# EAGLE design KMO_IO_MV1_2 (EAGLE 9.3.1)

## Sheet 1 of 2
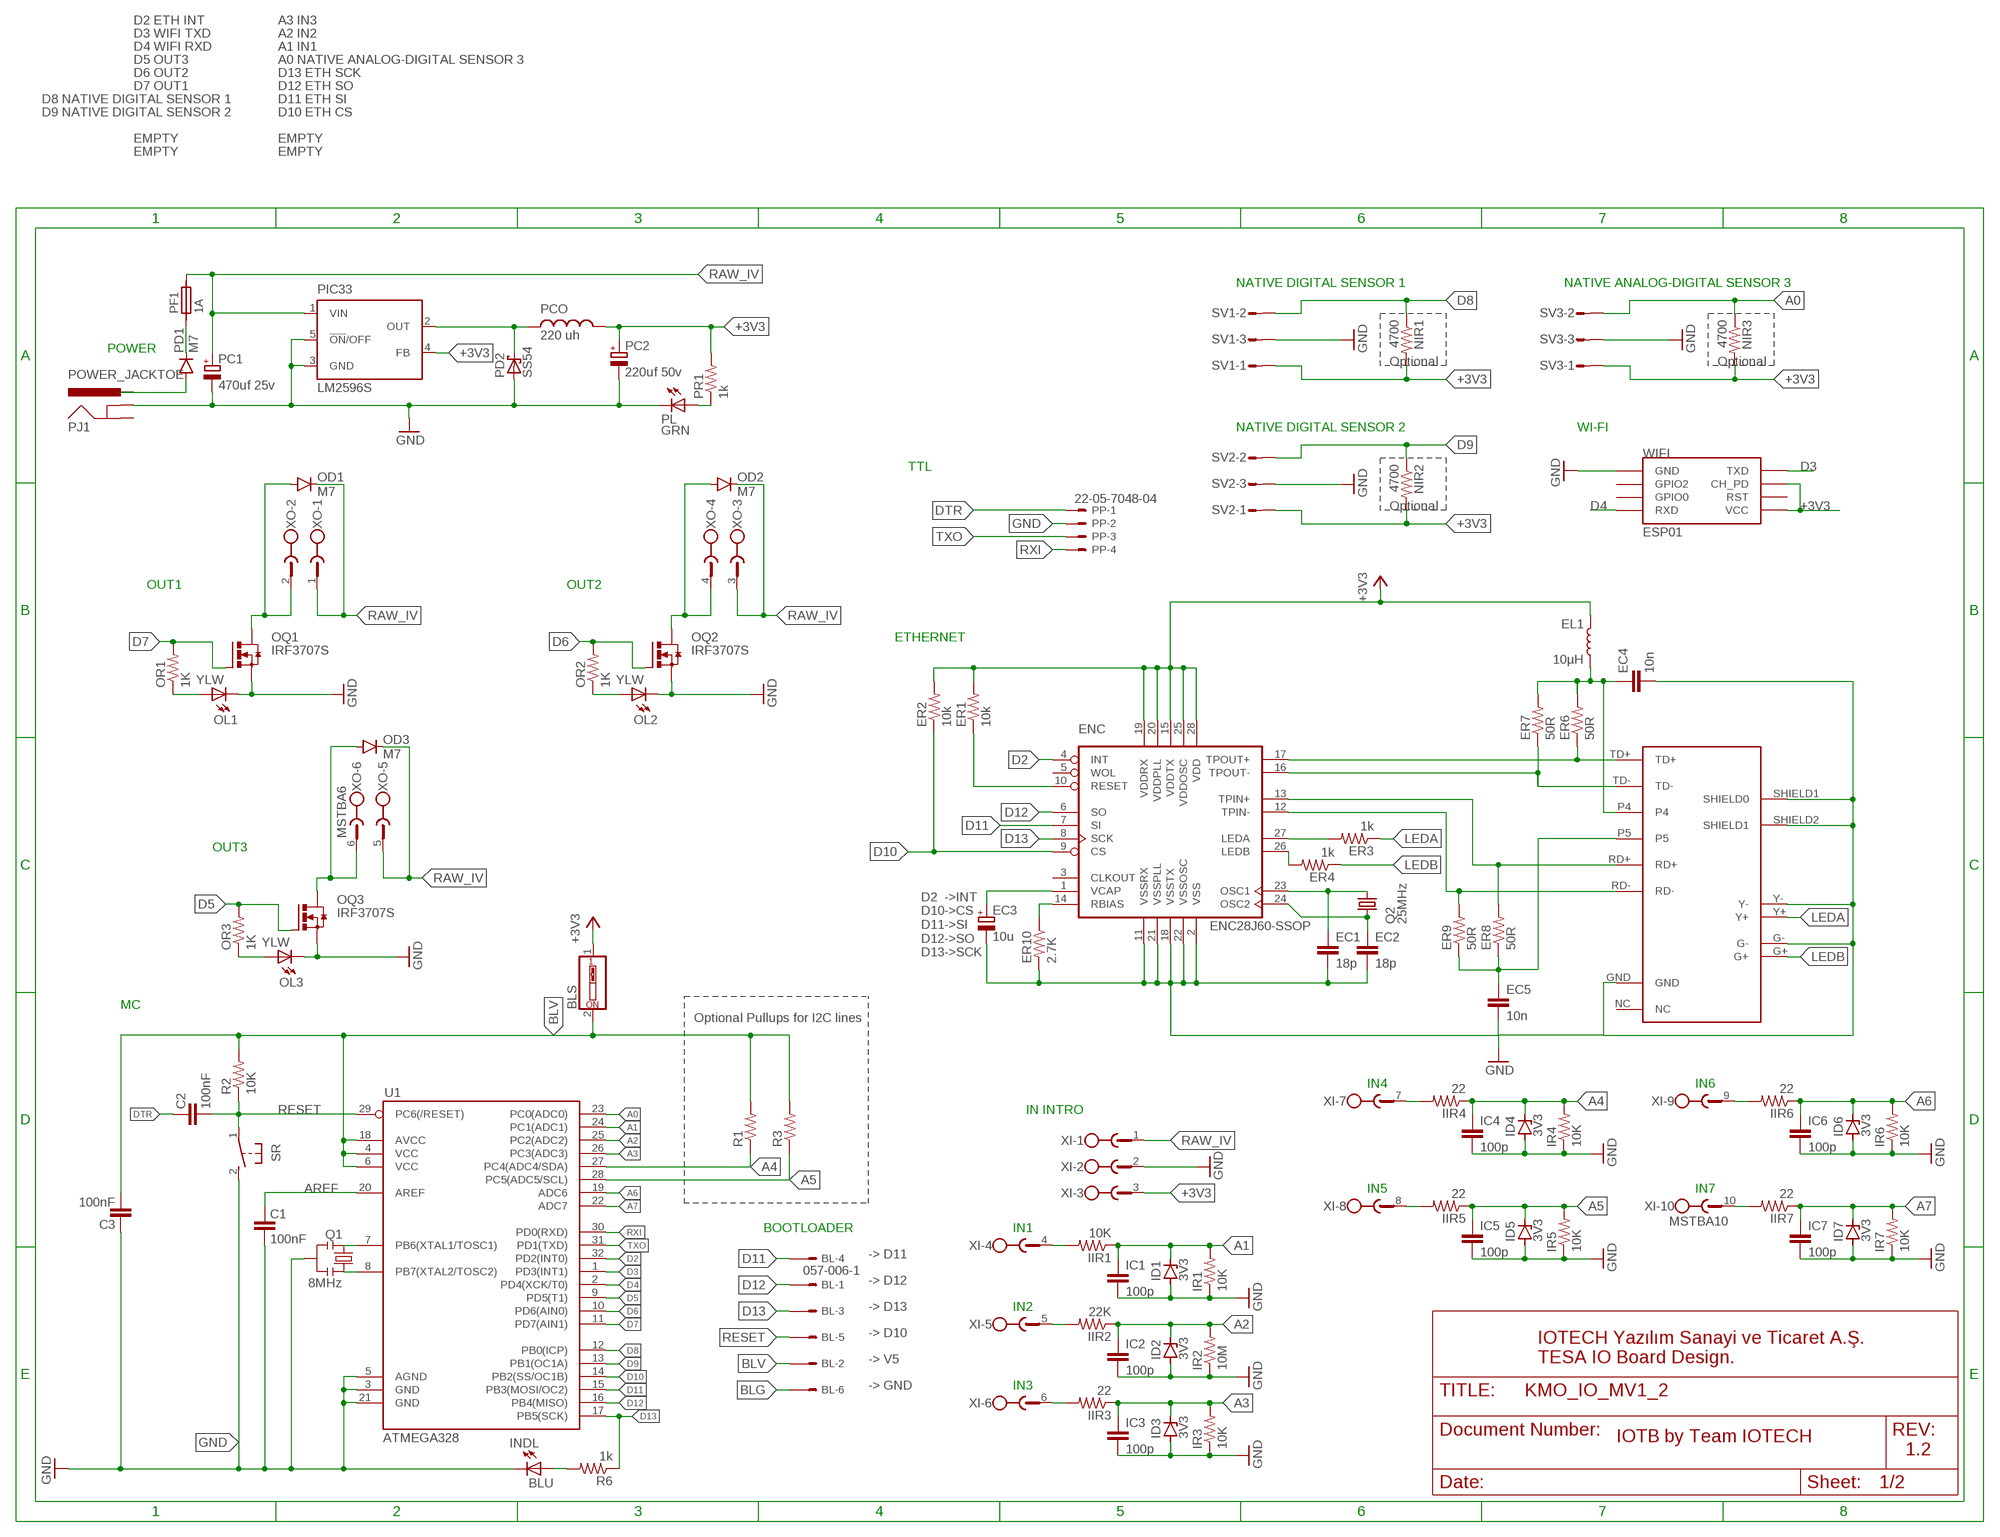
[diagram p0: schematic, sheet 1]

### Parts
BL  057-006-1  [057-006-1]
BLS  SW_DIP-1  [EDG-01]
C1  100nF  CAP0805  [0805]
C2  100nF  CAP0805  [0805]
C3  100nF  CAP0805  [0805]
EC1  18p  CAP0805  [0805]
EC2  18p  CAP0805  [0805]
EC3  10u  CPOL-EUCT3216  [CT3216]
EC4  10n  CAP0805  [0805]
EC5  10n  CAP0805  [0805]
EL1  10µH  INDUCTOR-0805-3.3UH  [0805]
ENC  ENC28J60-SSOP  [SSOP28]
ER1  10k  RESISTOR0805-RES  [0805]
ER2  10k  RESISTOR0805-RES  [0805]
ER3  1k  RESISTOR0805-RES  [0805]
ER4  1k  RESISTOR0805-RES  [0805]
ER6  50R  RESISTOR0805-RES  [0805]
ER7  50R  RESISTOR0805-RES  [0805]
ER8  50R  RESISTOR0805-RES  [0805]
ER9  50R  RESISTOR0805-RES  [0805]
ER10  2.7K  RESISTOR0805-RES  [0805]
IC1  100p  CAP0805  [0805]
IC2  100p  CAP0805  [0805]
IC3  100p  CAP0805  [0805]
IC4  100p  CAP0805  [0805]
IC5  100p  CAP0805  [0805]
IC6  100p  CAP0805  [0805]
IC7  100p  CAP0805  [0805]
ID1  3V3  ZENER-DIODESOT23  [SOT23]
ID2  3V3  ZENER-DIODESOT23  [SOT23]
ID3  3V3  ZENER-DIODESOT23  [SOT23]
ID4  3V3  ZENER-DIODESOT23  [SOT23]
ID5  3V3  ZENER-DIODESOT23  [SOT23]
ID6  3V3  ZENER-DIODESOT23  [SOT23]
ID7  3V3  ZENER-DIODESOT23  [SOT23]
IIR1  10K  RESISTOR0805-RES  [0805]
IIR2  22K  RESISTOR0805-RES  [0805]
IIR3  22  RESISTOR0805-RES  [0805]
IIR4  22  RESISTOR0805-RES  [0805]
IIR5  22  RESISTOR0805-RES  [0805]
IIR6  22  RESISTOR0805-RES  [0805]
IIR7  22  RESISTOR0805-RES  [0805]
INDL  BLU  LEDCHIP-LED0805  [CHIP-LED0805]
IR1  10K  RESISTOR0805-RES  [0805]
IR2  10M  RESISTOR0805-RES  [0805]
IR3  10K  RESISTOR0805-RES  [0805]
IR4  10K  RESISTOR0805-RES  [0805]
IR5  10K  RESISTOR0805-RES  [0805]
IR6  10K  RESISTOR0805-RES  [0805]
IR7  10K  RESISTOR0805-RES  [0805]
NIR1  4700  RESISTOR0805-RES  [0805]
NIR2  4700  RESISTOR0805-RES  [0805]
NIR3  4700  RESISTOR0805-RES  [0805]
OD1  M7  DIODESMA  [SMA-DIODE]
OD2  M7  DIODESMA  [SMA-DIODE]
OD3  M7  DIODESMA  [SMA-DIODE]
OL1  YLW  LEDCHIP-LED0805  [CHIP-LED0805]
OL2  YLW  LEDCHIP-LED0805  [CHIP-LED0805]
OL3  YLW  LEDCHIP-LED0805  [CHIP-LED0805]
OQ1  IRF3707S  IRF3704S  [D2PACK]
OQ2  IRF3707S  IRF3704S  [D2PACK]
OQ3  IRF3707S  IRF3704S  [D2PACK]
OR1  1K  RESISTOR0805-RES  [0805]
OR2  1K  RESISTOR0805-RES  [0805]
OR3  1K  RESISTOR0805-RES  [0805]
PC1  470uf 25v  CPOL-EU140CLH-1010  [140CLH-1010]
PC2  220uf 50v  CPOL-EU140CLH-1010  [140CLH-1010]
PCO  220 uh  MSS1260  [MSS1260]
PD1  M7  DIODESMA  [SMA-DIODE]
PD2  SS54  SCHOTTKY-DIODESMD  [SMB]
PF1  1A  SIBA194600  [1820]
PIC33  LM2596S  [TO263-5]
PJ1  POWER_JACKTOE  [POWER_JACK_SMD_OVERPASTE_TOE]
PL  GRN  LEDCHIP-LED0805  [CHIP-LED0805]
PP  22-05-7048-04  [7395-04]
PR1  1k  RESISTOR0805-RES  [0805]
Q1  8MHz  RESONATOR1:1  [RESONATOR-SMD-1:1]
Q2  25MHz  KX-9B  [5.0X3.2_2]
R1  RESISTOR0805-RES  [0805]
R2  10K  RESISTOR0805-RES  [0805]
R3  RESISTOR0805-RES  [0805]
R6  1k  RESISTOR0805-RES  [0805]
SR  31-XX  [B3F-31XX]
SV1  S03P  [S03P]
SV2  S03P  [S03P]
SV3  S03P  [S03P]
U1  ATMEGA328  ATMEGA168  [TQFP32-08]
U$2  HR911105A  [RJ45]
WIFI  ESP01  [ESP01]
XI  MSTBA10  [MSTBA10]
XO  MSTBA6  [MSTBA6]

### Nets
+3V3: BLS.1 EL1.1 ENC.15(VDDTX) ENC.19(VDDRX) ENC.20(VDDPLL) ENC.25(VDDOSC) ENC.28(VDD) ER1.2 ER2.2 NIR1.2 NIR2.2 NIR3.2 PC2.+ PCO.P$1 PIC33.4(FB) PR1.2 SV1.1 SV2.1 SV3.1 WIFI.CH_PD WIFI.VCC XI.3
A0: NIR3.1 SV3.2 U1.23(PC0(ADC0))
A1: IC1.1 ID1.3(C) IIR1.1 IR1.2 U1.24(PC1(ADC1))
A2: IC2.1 ID2.3(C) IIR2.1 IR2.2 U1.25(PC2(ADC2))
A3: IC3.1 ID3.3(C) IIR3.1 IR3.2 U1.26(PC3(ADC3))
A4: IC4.1 ID4.3(C) IIR4.1 IR4.2 R1.1 U1.27(PC4(ADC4/SDA))
A5: IC5.1 ID5.3(C) IIR5.1 IR5.2 R3.1 U1.28(PC5(ADC5/SCL))
A6: IC6.1 ID6.3(C) IIR6.1 IR6.2 U1.19(ADC6)
A7: IC7.1 ID7.3(C) IIR7.1 IR7.2 U1.22(ADC7)
AREF: C1.2 U1.20(AREF)
BLG: BL.6
BLV: BL.2 BLS.2 C3.1 R1.2 R2.2 R3.2 U1.4(VCC) U1.6(VCC) U1.18(AVCC)
D2: ENC.4(INT) U1.32(PD2(INT0))
D3: U1.1(PD3(INT1)) WIFI.TX(TXD)
D4: U1.2(PD4(XCK/T0)) WIFI.RX(RXD)
D5: OQ3.1(G) OR3.2 U1.9(PD5(T1))
D6: OQ2.1(G) OR2.2 U1.10(PD6(AIN0))
D7: OQ1.1(G) OR1.2 U1.11(PD7(AIN1))
D8: NIR1.1 SV1.2 U1.12(PB0(ICP))
D9: NIR2.1 SV2.2 U1.13(PB1(OC1A))
D10: ENC.9(CS) ER2.1 U1.14(PB2(SS/OC1B))
D11: BL.4 ENC.7(SI) U1.15(PB3(MOSI/OC2))
D12: BL.1 ENC.6(SO) U1.16(PB4(MISO))
D13: BL.3 ENC.8(SCK) R6.1 U1.17(PB5(SCK))
DTR: C2.2 PP.1
EP4: EC4.1 EL1.2 ER6.2 ER7.2 U$2.P4
EP5: EC5.1 ER8.1 ER9.1 U$2.P5
GND: C1.1 C3.2 EC1.2 EC2.2 EC3.- EC4.2 EC5.2 ENC.2(VSS) ENC.11(VSSRX) ENC.18(VSSTX) ENC.21(VSSPLL) ENC.22(VSSOSC) ER10.2 IC1.2 IC2.2 IC3.2 IC4.2 IC5.2 IC6.2 IC7.2 ID1.1(A) ID2.1(A) ID3.1(A) ID4.1(A) ID5.1(A) ID6.1(A) ID7.1(A) INDL.C IR1.1 IR2.1 IR3.1 IR4.1 IR5.1 IR6.1 IR7.1 OL1.C OL2.C OL3.C OQ1.3(S) OQ2.3(S) OQ3.3(S) PC1.- PC2.- PD2.A PIC33.3(GND) PIC33.5(!ON!/OFF) PJ1.GND(GNDBREAK) PL.C PP.2 Q1.2 SR.2(S) SV1.3 SV2.3 SV3.3 U1.3(GND) U1.5(AGND) U1.21(GND) U$2.G- U$2.GND U$2.SHIELD1(SHIELD0) U$2.SHIELD2(SHIELD1) U$2.Y- WIFI.GND XI.2
LEDA: ER3.1 U$2.Y+
LEDB: ER4.1 U$2.G+
N$1: OD3.A OQ3.2(D) XO.6
N$2: PD1.C PF1.1
N$3: OD1.A OQ1.2(D) XO.2
N$4: OD2.A OQ2.2(D) XO.4
N$5: INDL.A R6.2
N$6: OL3.A OR3.1
N$7: OL2.A OR2.1
N$8: OL1.A OR1.1
N$9: ENC.27(LEDA) ER3.2
N$10: Q1.3 U1.8(PB7(XTAL2/TOSC2))
N$11: PL.A PR1.1
N$12: IIR1.2 XI.4
N$13: EC3.+ ENC.1(VCAP)
N$14: ENC.26(LEDB) ER4.2
N$15: Q1.1 U1.7(PB6(XTAL1/TOSC1))
N$16: PCO.P$2 PD2.C PIC33.2(OUT)
N$17: ENC.10(RESET) ER1.1
N$18: PD1.A PJ1.VIN0(PWR)
N$19: ENC.14(RBIAS) ER10.1
N$20: IIR2.2 XI.5
N$21: IIR3.2 XI.6
N$22: EC2.1 ENC.24(OSC2) Q2.1
N$23: IIR4.2 XI.7
N$24: EC1.1 ENC.23(OSC1) Q2.2
N$25: IIR5.2 XI.8
N$26: IIR6.2 XI.9
N$27: IIR7.2 XI.10
RAW_IV [vcc]: OD1.C OD2.C OD3.C PC1.+ PF1.2 PIC33.1(VIN) XI.1 XO.1 XO.3 XO.5
RD+: ENC.13(TPIN+) ER8.2 U$2.RD+
RD-: ENC.12(TPIN-) ER9.2 U$2.RD-
RESET: BL.5 C2.1 R2.1 SR.1(P) U1.29(PC6(/RESET))
RXI: PP.4 U1.30(PD0(RXD))
TD+: ENC.17(TPOUT+) ER6.1 U$2.TD+
TD-: ENC.16(TPOUT-) ER7.1 U$2.TD-
TXO: PP.3 U1.31(PD1(TXD))
Unconnected: ENC.3(CLKOUT) ENC.5(WOL) PJ1.P$4(GND) U$2.NC WIFI.GPIO0 WIFI.GPIO2 WIFI.RST

### Notes on the sheet
- D2 ETH INT | A3 IN3
- D3 WIFI TXD | A2 IN2
- D4 WIFI RXD | A1 IN1
- D5 OUT3 | A0 NATIVE ANALOG-DIGITAL SENSOR 3
- D6 OUT2 | D13 ETH SCK
- D7 OUT1 | D12 ETH SO
- D8 NATIVE DIGITAL SENSOR 1 | D11 ETH SI
- D9 NATIVE DIGITAL SENSOR 2 | D10 ETH CS
- EMPTY | EMPTY
- EMPTY | EMPTY
- NATIVE DIGITAL SENSOR 1 | NATIVE ANALOG-DIGITAL SENSOR 3
- POWER
- Optional | Optional
- NATIVE DIGITAL SENSOR 2 | WI-FI
- TTL
- Optional
- OUT1 | OUT2
- ETHERNET
- OUT3
- D2  ->INT
  D10->CS
  D11->SI
  D12->SO
  D13->SCK
- MC
- Optional Pullups for I2C lines
- IN4 | IN6
- IN INTRO
- IN5 | IN7
- BOOTLOADER | IN1
- -> D11
- -> D12
- -> D13 | IN2
- -> D10
- -> V5
- IOTECH Yazılım Sanayi ve Ticaret A.Ş.
  TESA IO Board Design.
- -> GND | IN3
- IOTB by Team IOTECH
- 1.2

## Sheet 2 of 2
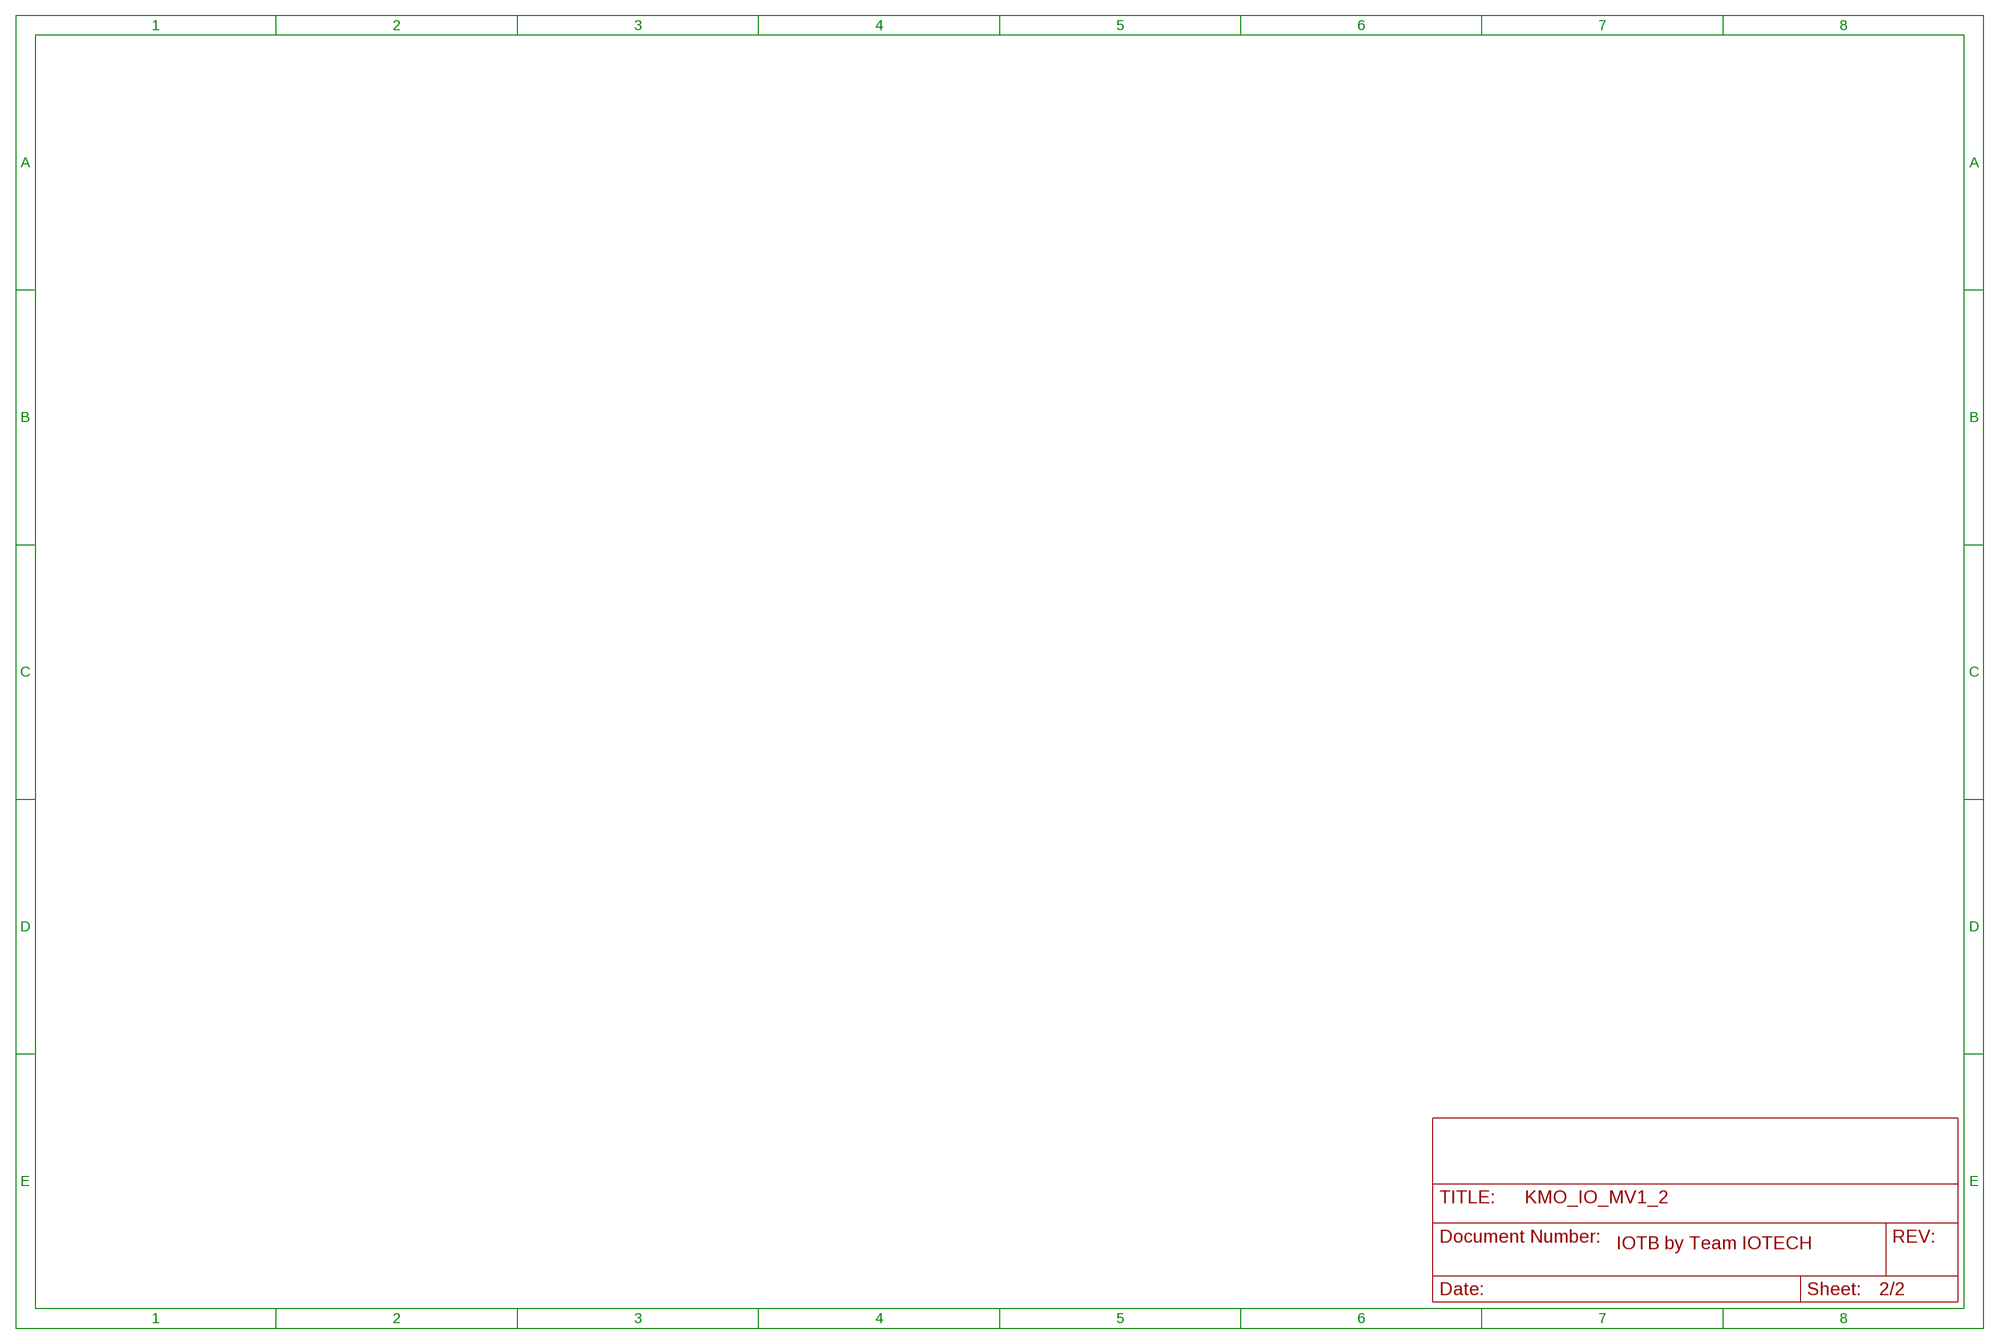
[diagram p1: schematic, sheet 2]

### Notes on the sheet
- IOTB by Team IOTECH

## Library data of the parts
BL = con-panduit:057-006-: CONNECTOR 6-pin series 057 contact pc board low profile headers; OC_FARNELL: unknown; OC_NEWARK: unknown
BLS = special:SW_DIP-1: DIP SWITCH
C1-C3 EC1 EC2 EC4 EC5 IC1-IC7 = SparkFun-Passives:CAP: Capacitor Standard 0603 ceramic capacitor, and 0.1" leaded capacitor.
EC3 PC1 PC2 = rcl:CPOL-EU: POLARIZED CAPACITOR, European symbol; SPICEPREFIX: C
EL1 = SparkFun-Coils:INDUCTOR: Inductors Resist changes in electrical current. Basically a coil of wire. SparkFun Products: SparkFun Load Cell Amplifier - HX711 <https://www.sparkfun.com/products/13879> IOIO-OTG - V2.2 <https://www.sparkfun.com/products/13613>; PROD_ID: NDUC-13076; VALUE: 3.3µH/±20%/450mA
ENC = microchip-enc28j60:ENC28J60-*: Microchip 10Mbit Eth. contoller with SPI interface
ER1-ER4 ER6-ER10 IIR1-IIR7 IR1-IR7 NIR1-NIR3 OR1-OR3 PR1 R1-R3 R6 = SparkFun-Passives:RESISTOR: Resistor Basic schematic elements and footprints for 0603, 1206, and PTH resistors.
ID1-ID7 = diode:ZENER-DIODE: Z-Diode
INDL OL1-OL3 PL = led:LED: LED OSRAM: - CHIPLED LG R971, LG N971, LY N971, LG Q971, LY Q971, LO R971, LY R971 LH N974, LH R974 LS Q976, LO Q976, LY Q976 LO Q996 - Hyper CHIPLED LW Q18S LB Q993, LB Q99A, LB R99A - SideLED LS A670, LO A670, LY A670, LG A670, LP A670 LB A673, LV A673, LT A673, LW A673 LH A674 LY A675 LS A676, LA A676, LO A676, LY A676, LW A676 LS A679, LY A679, LG A679 - Hyper Micro SIDELED® LS Y876, LA Y876, LO Y876, LY Y876 LT Y87S - SmartLED LW L88C, LW L88S LB L89C, LB L89S, LG L890 LS L89K, LO L89K, LY L89K LS L896, LA L896, LO L896, LY L896 - TOPLED LS T670, LO T670, LY T670, LG T670, LP T670 LSG T670, LSP T670, LSY T670, LOP T670, LYG T670 LG T671, LOG T671, LSG T671 LB T673, LV T673, LT T673, LW T673 LH T674 LS T676, LA T676, LO T676, LY T676, LB T676, LH T676, LSB T676, LW T676 LB T67C, LV T67C, LT T67C, LS T67K, LO T67K, LY T67K, LW E67C LS E67B, LA E67B, LO E67B, LY E67B, LB E67C, LV E67C, LT E67C LW T67C LS T679, LY T679, LG T679 LS T770, LO T770, LY T770, LG T770, LP T770 LB T773, LV T773, LT T773, LW T773 LH T774 LS E675, LA E675, LY E675, LS T675 LS T776, LA T776, LO T776, LY T776, LB T776 LHGB T686 LT T68C, LB T68C - Hyper Mini TOPLED® LB M676 - Mini TOPLED Santana® LG M470 LS M47K, LO M47K, LY M47K Source: http://www.osram.convergy.de LUXEON: - LUMILED® LXK2-PW12-R00, LXK2-PW12-S00, LXK2-PW14-U00, LXK2-PW14-V00 LXK2-PM12-R00, LXK2-PM12-S00, LXK2-PM14-U00 LXK2-PE12-Q00, LXK2-PE12-R00, LXK2-PE12-S00, LXK2-PE14-T00, LXK2-PE14-U00 LXK2-PB12-K00, LXK2-PB12-L00, LXK2-PB12-M00, LXK2-PB14-N00, LXK2-PB14-P00, LXK2-PB14-Q00 LXK2-PR12-L00, LXK2-PR12-M00, LXK2-PR14-Q00, LXK2-PR14-R00 LXK2-PD12-Q00, LXK2-PD12-R00, LXK2-PD12-S00 LXK2-PH12-R00, LXK2-PH12-S00 LXK2-PL12-P00, LXK2-PL12-Q00, LXK2-PL12-R00 Source: www.luxeon.com KINGBRIGHT: KA-3528ASYC Source: www.kingbright.com
OD1-OD3 PD1 = SparkFun-DiscreteSemi:DIODE: Diode These are standard reverse protection diodes and small signal diodes. SMA package can handle up to about 1A. SOD-323 can handle about 200mA. What the SOD-323 package when ordering, there are some mfgs out there that are 5-pin packages.
OQ1-OQ3 = transistor-power:IRF3704: SMPS MOSFET HEXFET® Power MOSFET Source: http://www.irf.com/product-info/datasheets/data/irf3704.pdf
PCO = inductor-coilcraft:MSS1260: SMT Power Inductor
PD2 = diode:SCHOTTKY-DIODE: Schottky Diode
PF1 = _hhn_PtcFuses_Siba_r500_Ozan:SIBA194600*: SIBA PTC-Fuses, Series 194600, 1812 (4.5 3.2)mm Source: www.siba.de/ Package: SMD 1812 (4.5 x 3.2)mm Technologies: SIBA194600Axxx xxx: Trip-Current * 10 mA Author: Dipl.-Ing. FH Rainer Bayer
PIC33 = national-semiconductor:LM2596: SIMPLE SWITCHER® Power Converter 150 kHz 3A Step-Down Voltage Regulator Source: http://www.national.com/ds/LM/LM2596.pdf; MF: NATIONAL SEMICONDUCTOR; MPN: LM2596S-ADJ/NOPB; OC_FARNELL: 9494367; OC_NEWARK: 41K3842
PJ1 = SparkFun-Connectors:POWER_JACK: Power Jack Connector This is the standard 5.5mm barrel jack for power. The PTH is the most common, proven, reliable, footprint. The Slot footprint only works if the mill layer is transmitted to the PCB fab house so be warned. Here are the connectors we sell at SparkFun: DC Barrel Power Jack/Connector <https://www.sparkfun.com/products/119> (PRT-00119) DC Barrel Power Jack/Connector (SMD) <https://www.sparkfun.com/products/12748> (PRT-12748) DC Barrel Jack Adapter - Breadboard Compatible <https://www.sparkfun.com/products/10811> (PRT-10811) It is used on this SparkFun product (and many, many others): SparkFun RedBoard - Programmed with Arduino <https://www.sparkfun.com/products/12757> (DEV-12757) Also, if you need a mating power supply or connector, please check these out: Wall Adapter Power Supply - 9VDC 650mA <https://www.sparkfun.com/products/298> (TOL-00298) DC Barrel Jack Adapter - Male <https://www.sparkfun.com/products/10287> (PRT-10287); PROD_ID: CONN-08106; SF_ID: PRT-12748
PP = con-molex:22-?-04: CONNECTOR wire to board 2.54 mm (.1 inch) pitch header; MF: MOLEX; OC_FARNELL: unknown; OC_NEWARK: unknown
Q1 = Testing:RESONATOR: Resonator Small SMD resonator. This is the itty bitty 10/20MHz resonators with built in caps. CSTCE10M0G55 and CSTCE20M0V53. Footprint for SMD has been used in SFE production for years, and does work okay. 1:1 is an attempt to get larger fillets on the sides so it will be easier to inspect these solders in our AOI machine. The pads have been minimized to match the actual metal under the resonator. To see this relation, it includes an image import of the bottom side of the component. Imported to scale on layer 200.
Q2 = crystal-geyer_V1_0:KX: Quartz Crystals (MHz) SMD: KX - Serie Model Size l/w/h [mm] Frequency Range Frequency Stability Temp. Range [°C] Load Capacitance AECQ 200 availabel Datasheet KX-4 KX-5 KX-6 KX-7 KX-9A KX-9B KX-12A KX-12B KX-13 KX-20 KX-K KX-KS 1.6/1.2/0.3 2.0/1.6/0.45 2.5/2.0/0.55 3.2/2.5/0.8 5.0/3.2/1.0 5.0/3.2/1.1 6.0/3.5/1.1 6.0/3.5/1.0 7.0/5.0 /1.3 11.6/5.5/1.6 12.3/4.5/4.2 12.3/4.5/3.2 24.0 ~ 80.0 MHz 16.0 ~ 80.0 MHz 12.0 ~ 80.0 MHz 8.0 ~ 60.0 MHz 7,68 ~ 300,0 MHz 8,0 ~ 50,0 MHz 8,0 ~ 150,0 MHz 8,0 ~ 50,0 MHz 6,0 ~ 160,0 MHz 3,579 ~ 25,0 MHz 3,579 ~ 70,0 MHz 3,579 ~ 70,0 MHz ±10 … ±50ppm ±10 … ±50ppm ±10 … ±50ppm ±10 … ±50ppm ±10 … ±50ppm ±10 … ±50ppm ±10 … ±50ppm ±10 … ±50ppm ±10 … ±50ppm ±50ppm ±10 … ±50ppm ±10 … ±50ppm (*) -40°C …+85°C (*) -40°C …+125°C (*) -40°C …+125°C (*) -40°C …+125°C (*) -40°C …+105°C (*) -40°C …+105°C (*) -40°C …+125°C (*) -40°C …+105°C (*) -40°C …+105°C (*) -40°C …+105°C (*) -40°C …+85°C (*) -40°C …+85°C 8, 8…16 8, 8…16 10, 8…16 12, 7…20 16, 10…20 16, 10…20 16, 10…20 16, 12…20 16, 12…20 16, 12…20 16, 12…30 16, 12…30 - yes yes yes - - - - - - - - KX-4.pdf <http://www.geyer-electronic.de/uploads/tx_userartikelfrequenz/GEYER-KX-4.pdf> KX-5.pdf <http://www.geyer-electronic.de/uploads/tx_userartikelfrequenz/GEYER-KX-5.pdf> KX-6.pdf <http://www.geyer-electronic.de/uploads/tx_userartikelfrequenz/GEYER-KX-6.pdf> KX-7.pdf <http://www.geyer-electronic.de/uploads/tx_userartikelfrequenz/GEYER-KX-7.pdf> KX-9A.pdf <http://www.geyer-electronic.de/uploads/tx_userartikelfrequenz/GEYER-KX-9A.pdf> KX-9B.pdf <http://www.geyer-electronic.de/uploads/tx_userartikelfrequenz/GEYER-KX-9B.pdf> KX-12A.pdf <http://www.geyer-electronic.de/uploads/tx_userartikelfrequenz/GEYER-KX-12A.pdf> KX-12B.pdf <http://www.geyer-electronic.de/uploads/tx_userartikelfrequenz/GEYER-KX-12B.pdf> KX-13.pdf <http://www.geyer-electronic.de/uploads/tx_userartikelfrequenz/GEYER-KX-13.pdf> KX-20.pdf <http://www.geyer-electronic.de/uploads/tx_userartikelfrequenz/GEYER-KX-20.pdf> KX-K.pdf <http://www.geyer-electronic.de/uploads/tx_userartikelfrequenz/GEYER-KX-K.pdf> KX-KS.pdf <http://www.geyer-electronic.de/uploads/tx_userartikelfrequenz/GEYER-KX-KS.pdf> <http://www.geyer-electronic.de/fileadmin/template/img/logo-geyer-electronic.png> Details see: http://www.geyer-electronic.de/Frequenz-Produkte.9.0.html Created 2016-06-07, Hans Locher 2016 (C) Geyer Quartz Technology KX4,KX5,KX6,KX7,KX9A,KX9B,KX12A,KX12B,KX13,KX20,KXK,KXKS;1612;2016;2520;3225;5032;6035;7050;11655;12345;1,6x1,2;2,0x1,6;2,5x2,0;3,2x2,5;5,0x3,2;6,0x3,5;7,0x5,0;11,6x5,5;12,3x4,5;12,3x4,5;1.6x1.2;2.0x1.6;2.5x2.0;3.2x2.5;5.0x3.2;6.0x3.5;7.0x5.0;11.6x5.5;12.3x4.5;12.3x4.5;
SR = switch-omron:31-XX: OMRON SWITCH; MPN: B3F-3100; OC_FARNELL: 959704; OC_NEWARK: 36M3582
SV1-SV3 = con_io_sxp:S03P: AMP MT CONNECTOR
U1 = SparkFun:ATMEGA168
U$2 = HR911105A:HR911105A
WIFI = esp8266modules:ESP01: ESP8266 Wifi module 01
XI = con-phoenix-508:MSTBA10: PHOENIX; MF: FARNELL; MPN: 1757323; OC_FARNELL: 3705249; OC_NEWARK: 71C4168
XO = con-phoenix-508:MSTBA6: PHOENIX; MF: FARNELL; MPN: 1757284; OC_FARNELL: 3705213; OC_NEWARK: 71C4165

## Net classes
0 default: width 0.203 mm, drill 0.3 mm, clearance 0.16 mm
1 vcc: width 0.254 mm, drill 0.3 mm, clearance 0.16 mm

## Board
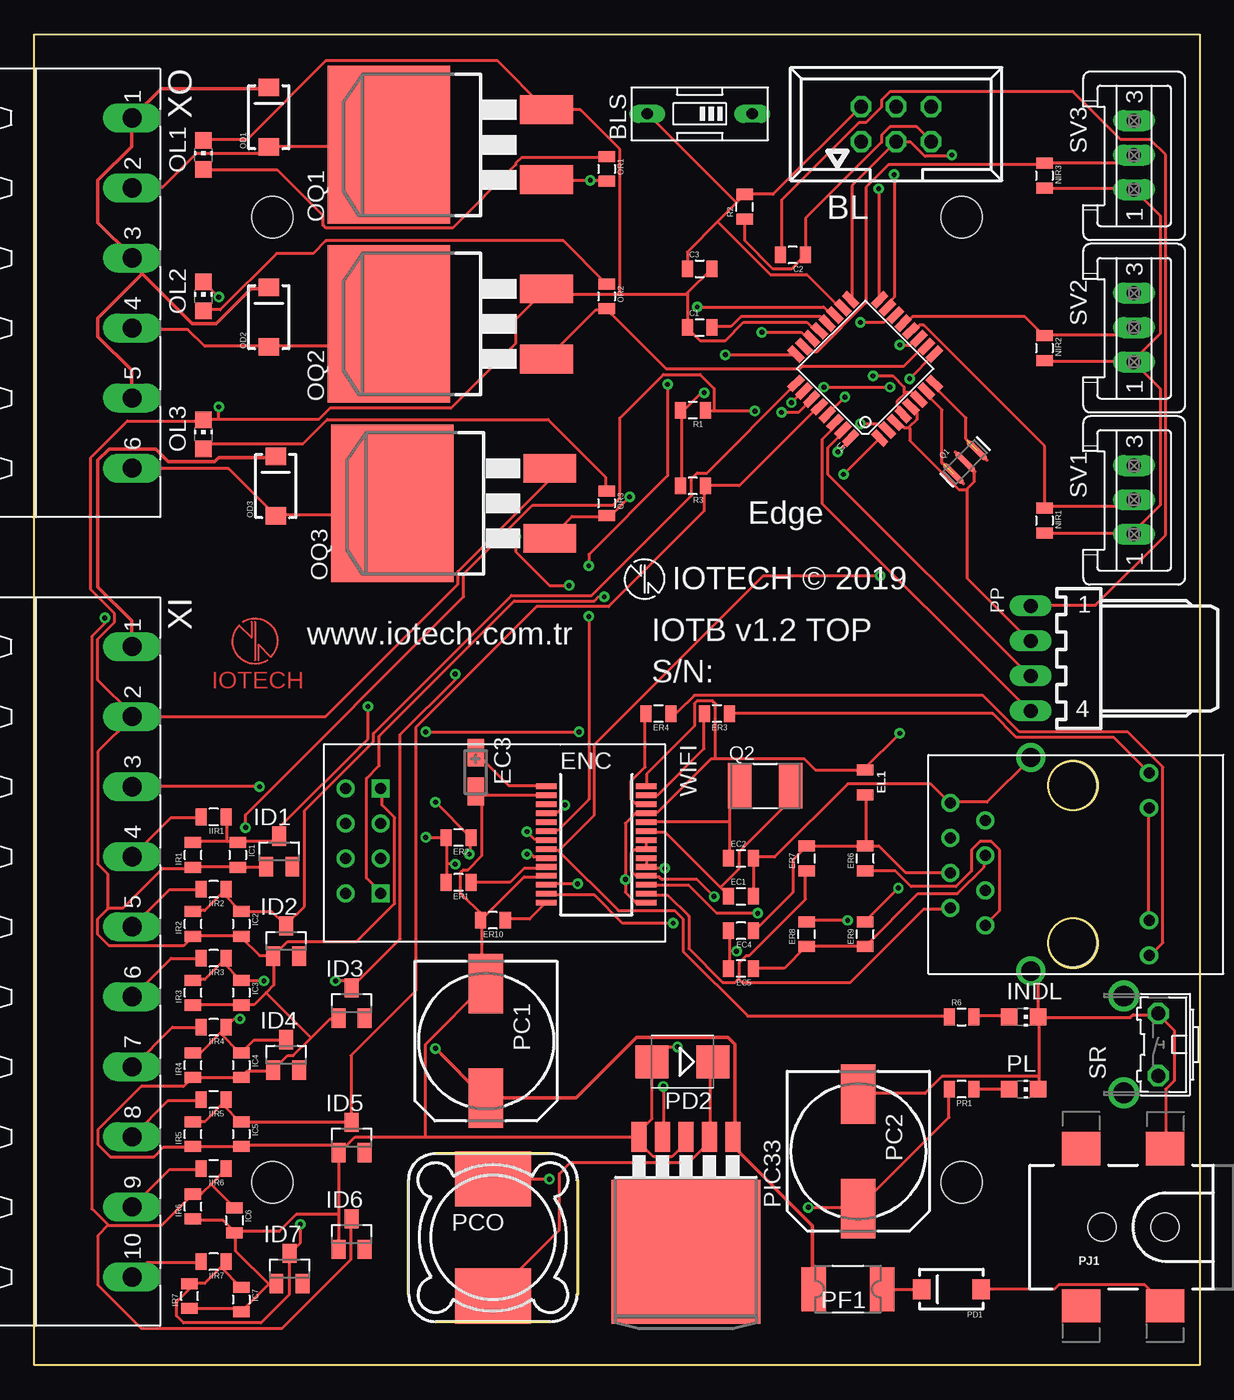
[diagram p2: board, top side]
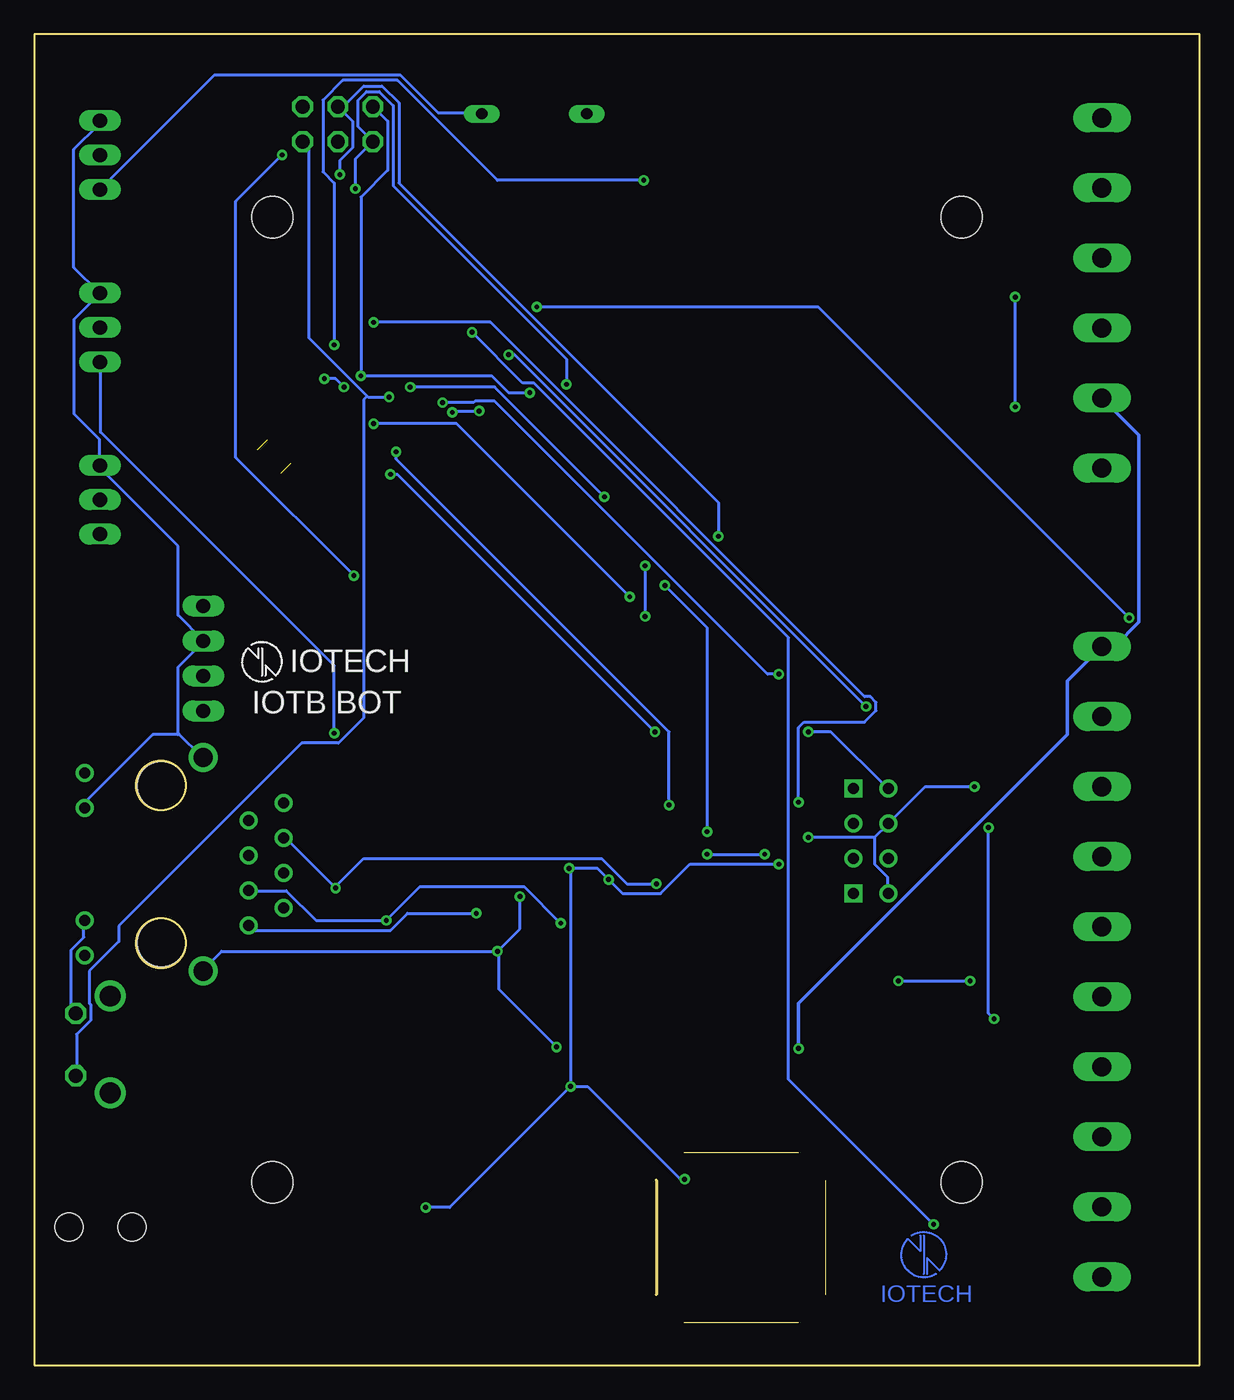
[diagram p3: board, bottom side, seen from below]

Size 84.5 x 96.5 mm. Coordinates in mm from the lower left corner, seen from the top.
Outline: 0,0 0,96.5 84.5,96.5 84.5,0 0,0
Copper layers (1*16): Top 0.035mm / dielectric 1.5mm / Bottom 0.035mm
Design rules "KMO_IO_M": minimum track width 6mil, minimum drill 0.35mm, track to track 0.205mm, track to pad 0.205mm, pad to pad 0.205mm, via to via 0.205mm, smd to smd 6mil, copper to edge 40mil, drill to drill 6mil, minimum pad ring 10mil, minimum via ring 8mil, stop-mask expansion 4mil, vias tented up to drill 0mil, thermal gap 10mil
Holes 3 mm at 17.25,83.25 67.25,83.25 17.25,13.25 67.25,13.25

### Footprints (pad centres in the part's own frame; a part is rotated, then mirrored left to right if it is on the bottom)
057-006-1 = drill 1 octagon: 1 -2.54,-1.27; 2 -2.54,1.27; 3 0,-1.27; 4 0,1.27; 5 2.54,-1.27; 6 2.54,1.27
EDG-01 = drill 0.813 long: 1 0,-3.81; 2 0,3.81
0805 = smd 0.8 x 1.2: 1 -0.9,0; 2 0.9,0
CT3216 = smd 2 x 1.2: + -1.4,0; - 1.4,0
SSOP28 = smd 0.4 x 1.5: 1 -4.225,-3.625; 2 -3.575,-3.625; 3 -2.925,-3.625; 4 -2.275,-3.625; 5 -1.625,-3.625; 6 -0.975,-3.625; 7 -0.325,-3.625; 8 0.325,-3.625; 9 0.975,-3.625; 10 1.625,-3.625; 11 2.275,-3.625; 12 2.925,-3.625; 13 3.575,-3.625; 14 4.225,-3.625; 15 4.225,3.625; 16 3.575,3.625; 17 2.925,3.625; 18 2.275,3.625; 19 1.625,3.625; 20 0.975,3.625; 21 0.325,3.625; 22 -0.325,3.625; 23 -0.975,3.625; 24 -1.625,3.625; 25 -2.275,3.625; 26 -2.925,3.625; 27 -3.575,3.625; 28 -4.225,3.625
SOT23 = smd 1 x 1.4: 1 -0.95,-1.1; 2 0.95,-1.1; 3 0,1.1
CHIP-LED0805 = smd 1.2 x 1.2: A 0,-1.05; C 0,1.05
SMA-DIODE = smd 1.27 x 1.47: A -2.15,0; C 2.15,0
D2PACK = smd 2.083 x 3.81: 1 -2.54,-8.89; 3 2.54,-8.89 | smd 11.43 x 8.89: 2 0,2.54
140CLH-1010 = smd 4.3 x 2.5: + 4.15,0; - -4.15,0
MSS1260 = smd 5.5 x 4: P$1 0,4.25; P$2 0,-4.25
SMB = smd 2.4 x 2.4: A 2.2,0; C -2.2,0
1820 = smd 1.78 x 3.2: 1 -2.49,0; 2 2.49,0
TO263-5 = smd 1.067 x 2.159: 1 -3.404,-5.791; 2 -1.702,-5.791; 3 0,-5.791; 4 1.702,-5.791; 5 3.404,-5.791 | smd 10.8 x 10.41: 6 0,2.54
POWER_JACK_SMD_OVERPASTE_TOE = smd 2.8 x 2.4: GND 0,-5.7; P$4 6.1,-5.7; VIN0 0,5.7; VIN1 6.1,5.7 | hole 2.032: 0,0; 4.572,0
7395-04 = drill 1.016 long: 1 3.81,0; 2 1.27,0; 3 -1.27,0; 4 -3.81,0
RESONATOR-SMD-1:1 = smd 0.45 x 1.905: 1 -1.2,0; 2 0,0; 3 1.2,0
5.0X3.2_2 = smd 1.7 x 3.3: 1 -1.85,0; 2 1.85,0
B3F-31XX = drill 1.016 octagon: 1 -2.261,-1.245; 2 2.261,-1.245 | drill 1.499 pad 2.159: 3 -3.505,1.245; 4 3.505,1.245
S03P = drill 1.016 long: 1 2.5,0; 2 0,0; 3 -2.5,0
TQFP32-08 = smd 1.27 x 0.559: 1 -4.293,2.8; 2 -4.293,2; 3 -4.293,1.2; 4 -4.293,0.4; 5 -4.293,-0.4; 6 -4.293,-1.2; 7 -4.293,-2; 8 -4.293,-2.8; 17 4.293,-2.8; 18 4.293,-2; 19 4.293,-1.2; 20 4.293,-0.4; 21 4.293,0.4; 22 4.293,1.2; 23 4.293,2; 24 4.293,2.8 | smd 0.559 x 1.27: 9 -2.8,-4.293; 10 -2,-4.293; 11 -1.2,-4.293; 12 -0.4,-4.293; 13 0.4,-4.293; 14 1.2,-4.293; 15 2,-4.293; 16 2.8,-4.293; 25 2.8,4.293; 26 2,4.293; 27 1.2,4.293; 28 0.4,4.293; 29 -0.4,4.293; 30 -1.2,4.293; 31 -2,4.293; 32 -2.8,4.293
RJ45 = drill 0.8: G+ 5.84,-6.305; G- 5.84,-3.765; GND -8.57,4.76; NC -6.03,3.5; P4 -8.57,-0.32; P5 -6.03,0.96; RD+ -6.03,-1.58; RD- -8.57,2.22; TD+ -6.03,-4.12; TD- -8.57,-2.86; Y+ 5.84,6.945; Y- 5.84,4.405 | drill 1.4: SHIELD1 -2.73,-7.425; SHIELD2 -2.73,8.065 | hole 3.5: 0.3,-5.38; 0.3,6.02
ESP01 = drill 0.8: CH_PD -1.285,-8.178; GPIO0 1.255,-5.638; GPIO2 -1.285,-5.638; RST 1.255,-8.178; TX -3.825,-8.178; VCC 3.795,-8.178 | drill 0.8 square: GND -3.825,-5.638; RX 3.795,-5.638
MSTBA10 = drill 1.397 long: 1 -22.86,5.08; 2 -17.78,5.08; 3 -12.7,5.08; 4 -7.62,5.08; 5 -2.54,5.08; 6 2.54,5.08; 7 7.62,5.08; 8 12.7,5.08; 9 17.78,5.08; 10 22.86,5.08
MSTBA6 = drill 1.397 long: 1 -12.7,5.08; 2 -7.62,5.08; 3 -2.54,5.08; 4 2.54,5.08; 5 7.62,5.08; 6 12.7,5.08

### Placement (x,y rotation side)
BL  62.5,90 0 top
BLS  48.25,90.75 90 top
C1  48.25,75.25 0 top
C2  55,80.5 180 top
C3  48.25,79.5 0 top
EC1  51.25,34 0 top
EC2  51.25,36.75 0 top
EC3  32,43 270 top
EC4  51.25,31.5 180 top
EC5  51.25,28.75 180 top
EL1  60.25,42.25 270 top
ENC  40.75,37.75 270 top
ER1  30.75,35 180 top
ER2  30.75,38.25 180 top
ER3  49.5,47.25 180 top
ER4  45.25,47.25 180 top
ER6  60.25,36.75 90 top
ER7  56,36.75 90 top
ER8  56,31.25 90 top
ER9  60.25,31.25 90 top
ER10  33.25,32.25 180 top
IC1  14.75,37 270 top
IC2  15,32 270 top
IC3  15,27 270 top
IC4  15,21.75 270 top
IC5  15,16.75 270 top
IC6  14.5,10.5 270 top
IC7  15,4.75 270 top
ID1  17.75,37.25 0 top
ID2  18.25,30.75 0 top
ID3  23,26.25 0 top
ID4  18.25,22.5 0 top
ID5  23,16.5 0 top
ID6  23,9.5 0 top
ID7  18.5,7 0 top
IIR1  13,39.75 180 top
IIR2  13,34.5 180 top
IIR3  13,29.5 180 top
IIR4  13,24.5 180 top
IIR5  13,19.25 180 top
IIR6  13,14.25 180 top
IIR7  13,7.5 180 top
INDL  71.75,25.25 270 top
IR1  11.5,37 90 top
IR2  11.5,32 90 top
IR3  11.5,27 90 top
IR4  11.5,21.75 90 top
IR5  11.5,16.75 90 top
IR6  11.5,11.5 90 top
IR7  11.25,5 90 top
NIR1  73.25,61.25 270 top
NIR2  73.25,73.75 270 top
NIR3  73.25,86.25 270 top
OD1  17,90.5 90 top
OD2  17,76 90 top
OD3  17.5,63.75 90 top
OL1  12.25,87.75 0 top
OL2  12.25,77.5 0 top
OL3  12.25,67.5 0 top
OQ1  28.25,88.5 90 top
OQ2  28.25,75.5 90 top
OQ3  28.5,62.5 90 top
OR1  41.5,86.75 270 top
OR2  41.5,77.5 270 top
OR3  41.5,62.5 270 top
PC1  32.75,23.5 270 top
PC2  59.75,15.5 270 top
PCO  33.25,9.25 0 top
PD1  66.5,5.5 180 top
PD2  47,22 180 top
PF1  59,5.5 180 top
PIC33  47.25,10.75 180 top
PJ1  82,10 180 top
PL  71.75,20 270 top
PP  72.25,51.25 90 top
PR1  67.25,20 180 top
Q1  67.5,65.5 45 top
Q2  53,42 0 top
R1  47.75,69.25 180 top
R2  51.5,84 90 top
R3  47.75,63.75 180 top
R6  67.25,25.25 0 top
SR  80.25,23.25 90 top
SV1  79.75,62.75 270 top
SV2  79.75,75.25 270 top
SV3  79.75,87.75 270 top
U1  60.25,72.25 135 top
U$1  [IOTECH_COPPER_W_TEXT]  16,52.5 0 top
U$2  75,36 0 top
U$4  [IOTECH_COPPER_W_TEXT]  20,8 0 bottom
WIFI  30.75,38 270 top
XI  2,29.25 270 top
XO  2,77.75 270 top

### Tracks (layer width: path | path; a pad name or v marks a point on that pad's centre or on a via)
+3V3  (via drill 0.35)
  Top 0.203: NIR1.2 73.27,60.31 79.7,60.31 SV1.1 79.7,60.41 81.64,62.35 81.64,70.82 79.8,72.66 SV2.1 | NIR2.2 73.27,72.76 79.7,72.76 SV2.1 | NIR3.2 73.27,85.31 79.7,85.31 SV3.1 79.8,85.21 81.64,83.38 81.64,74.8 79.7,72.86 SV2.1 | 29.9,36.33 29.9,38.17 ER2.2 29.8,38.27 v28.37,38.27 | 29.9,36.33 29.9,35 ER1.2 | v16.33,41.94 7.14,41.94 XI.3 | PR1.2 66.33,19.9 66.33,17.96 59.8,11.43 PC2.+ 59.7,11.43 v56.13,11.43 | ENC.20 44.39,36.74 44.39,36.13 ENC.19 44.39,36.02 v45.72,36.02 | 49.39,43.98 49.09,43.98 45.21,40.11 44.39,40.11 ENC.25 44.29,40 43.58,40 42.86,39.29 v42.86,35.21 42.86,34.29 43.58,33.57 44.29,33.57 ENC.15 | 49.39,43.98 55.82,43.98 56.64,43.17 60.21,43.17 EL1.1 60.21,43.27 v62.76,45.82 | 49.39,43.98 49.39,47.96 49.19,48.17 48.07,48.17 47.86,47.96 47.86,46.33 44.39,42.86 44.39,42.05 ENC.28 | v45.62,20.21 45.62,16.63 PIC33.4 | v37.35,13.47 33.27,13.47 PCO.P$1 | v30.51,36.33 29.9,36.33
  Bottom 0.203: BLS.1 52.15,90.83 55.21,90.83 57.96,93.58 71.44,93.58 79.7,85.31 SV3.1 | 23.57,38.27 v28.37,38.27 | 23.57,38.27 22.66,39.19 WIFI.CH_PD 22.55,39.29 19.9,41.94 v16.33,41.94 | 23.57,38.27 23.57,36.33 22.66,35.41 22.66,34.29 WIFI.VCC | 45.62,36.02 43.68,36.02 v42.86,35.21 41.84,34.19 39.09,34.19 36.94,36.33 v30.51,36.33 | 45.62,36.02 v45.62,20.21 | 45.62,36.02 v45.72,36.02 | v37.35,13.47 37.66,13.47 44.39,20.21 v45.62,20.21 | v56.13,11.43 54.39,11.43 v45.62,20.21 | v62.76,45.82 62.76,50.72 79.7,67.66 79.7,72.66 SV2.1
A0
  Top 0.203: SV3.2 79.7,87.66 79.19,87.15 73.27,87.15 NIR3.1 73.17,87.05 61.94,87.05 60.31,85.42 60.31,77.05 56.74,73.48 56.43,73.48 56.13,73.78 55.82,73.78 U1.23
A1  (via drill 0.35)
  Top 0.203: 13.98,37.96 14.7,37.96 IC1.1 14.8,37.96 17.35,37.96 17.66,38.27 ID1.3 17.76,38.37 17.76,38.98 24.19,45.41 v24.19,47.76 | 13.98,37.96 11.53,37.96 IR1.2 | 13.98,37.96 13.98,39.7 IIR1.1 | v50.11,73.27 55.21,73.27 U1.24
  Bottom 0.203: v50.11,73.27 49.7,73.27 v24.19,47.76
A2
  Top 0.203: IR2.2 11.53,32.96 12.35,32.96 13.88,34.49 IIR2.1 13.68,34.19 14.9,32.96 IC2.1 15,32.86 17.25,32.86 18.16,31.94 ID2.3 18.27,31.94 19.59,33.27 19.59,40.21 24.59,45.21 24.59,45.82 34.59,55.82 40.41,55.82 47.66,63.07 47.66,64.29 48.07,64.7 48.78,64.7 55.21,71.13 U1.25
A3  (via drill 0.35)
  Top 0.203: IR3.2 11.53,27.96 12.35,27.96 13.88,29.49 IIR3.1 13.68,29.19 14.9,27.96 IC3.1 15,27.86 v16.63,27.86 | v54.9,69.8 55.72,70.62 U1.26 | v30.51,50.11 30.51,49.7 26.53,45.72 26.53,30.92 23.06,27.45 ID3.3 22.96,27.45 22.55,27.86 v21.84,27.86
  Bottom 0.203: v54.9,69.8 52.66,69.8 52.56,69.9 51.13,69.9 31.33,50.11 v30.51,50.11 | v21.84,27.86 v16.63,27.86
A4  (via drill 0.35)
  Top 0.203: v52.25,69.19 49.29,69.19 | 49.29,69.19 48.68,69.19 R1.1 | v54.19,69.09 55.41,69.09 56.33,70.01 U1.27 | 13.47,24.08 13.88,24.49 IIR4.1 13.98,24.59 14.49,25.1 v14.9,25.1 | 13.47,24.08 12.04,22.66 11.53,22.66 IR4.2 | 13.47,24.08 14.9,22.66 IC4.1 15.92,23.57 18.16,23.57 ID4.3 | 49.29,69.19 49.29,70.82 48.27,71.84 45.62,71.84 42.45,68.68 42.45,62.86 41.94,62.35 36.13,62.35 31.12,57.35 31.12,55.72 15.31,39.9 v15.31,38.98
  Bottom 0.203: v52.25,69.19 54.09,69.19 v54.19,69.09 | v15.31,38.98 15.31,25.51 v14.9,25.1
A5
  Top 0.203: IR5.2 11.53,17.66 12.35,17.66 13.88,19.18 IIR5.1 13.68,18.88 14.9,17.66 IC5.1 22.96,17.66 ID5.3 22.96,17.76 22.96,22.45 27.66,27.14 27.66,46.23 36.43,55.01 41.64,55.01 48.58,61.94 48.58,63.68 R3.1 48.68,63.78 51.13,63.78 56.84,69.5 U1.28
A6  (via drill 0.35)
  Top 0.203: 12.81,13.11 13.88,14.19 IIR6.1 | 12.81,13.11 12.14,12.45 11.53,12.45 IR6.2 11.43,12.35 9.18,10.1 5.41,10.1 5.36,10.15 | 12.81,13.11 14.49,11.43 IC6.1 | v48.07,76.74 57.25,76.74 57.76,76.23 57.96,76.23 U1.19 | v5.1,54.19 5.1,53.78 4.18,52.86 4.18,11.33 5.36,10.15 | 5.36,10.15 4.59,9.39 4.59,5.82 7.76,2.65 17.96,2.65 22.96,7.65 22.96,10.51 ID6.3
  Bottom 0.203: v48.07,76.74 27.66,76.74 v5.1,54.19
A7  (via drill 0.35)
  Top 0.203: IC7.1 14.9,5.71 13.57,7.04 IIR7.1 13.88,7.45 12.35,5.92 11.33,5.92 IR7.2 11.23,5.82 11.23,5.51 10.31,4.59 10.31,3.57 10.82,3.06 16.43,3.06 18.47,5.1 18.47,8.06 ID7.3 18.57,8.16 19.29,8.88 v19.29,10.21 | v52.76,74.91 55.62,74.91 56.02,74.5 56.33,74.5 U1.22
  Bottom 0.203: v52.76,74.91 49.09,71.23 48.27,71.23 29.8,52.76 29.8,20.72 v19.29,10.21
AREF
  Top 0.203: C1.2 49.19,75.31 50.52,75.31 51.23,76.03 57.05,76.03 57.45,75.62 U1.20
BLV  (via drill 0.35)
  Top 0.203: 50.92,84.29 51.43,84.8 R2.2 51.53,84.91 53.58,84.91 59.9,91.23 BL.2 | 50.92,84.29 49.55,82.92 | 49.55,82.92 47.35,80.72 47.35,79.6 C3.1 | 49.55,82.92 53.37,79.09 56.02,79.09 58.37,76.74 58.58,76.74 U1.18 | 50.92,84.29 44.49,90.72 BLS.2 | R3.2 46.94,63.78 46.94,69.19 R1.2 47.05,69.19 48.37,70.52 v48.58,70.52 | 63.12,70.47 63.17,70.52 63.68,70.52 64.09,70.11 U1.6 | 63.12,70.47 62.56,69.9 62.56,69.6 62.97,69.19 62.97,68.99 U1.4 | v60.82,71.74 62.25,71.74 63.07,70.92 63.07,70.52 63.12,70.47
  Bottom 0.203: BL.2 59.9,91.23 58.88,90.21 58.88,86.64 60.82,84.7 v60.82,71.74 51.33,71.74 50.11,70.52 v48.58,70.52
D2  (via drill 0.35)
  Top 0.203: v58.27,66.23 59.19,67.15 U1.32 | v38.47,40.62 37.96,40.11 37.15,40.11 ENC.4
  Bottom 0.203: v58.27,66.23 58.27,65.72 38.47,45.92 v38.47,40.62
D3  (via drill 0.35)
  Top 0.203: v58.68,64.6 61.23,67.15 U1.1 | v28.37,45.92 v39.49,45.92
  Bottom 0.203: v58.68,64.6 58.17,64.6 v39.49,45.92 | v28.37,45.92 26.74,45.92 22.66,41.84 WIFI.TX
D4  (via drill 0.35)
  Top 0.203: v59.9,68.27 61.13,68.27 61.54,67.86 61.84,67.86 U1.2 | v41.33,55.72 40.92,55.72 40.62,55.41 34.8,55.41 25,45.62 25,43.47 24.08,42.55 24.08,35.31 25.1,34.29 WIFI.RX
  Bottom 0.203: v59.9,68.27 53.88,68.27 v41.33,55.72
D5  (via drill 0.35)
  Top 0.203: OQ3.1 37.45,60.01 38.98,61.54 41.43,61.54 OR3.2 41.53,61.64 41.84,61.64 v43.17,62.97 | v63.48,71.54 65.21,73.27 U1.9 | v57.25,70.92 v62.05,70.92
  Bottom 0.203: v63.48,71.54 62.66,71.54 v62.05,70.92 | v57.25,70.92 51.13,70.92 v43.17,62.97
D6
  Top 0.203: OQ2.1 40.72,76.54 41.43,76.54 OR2.2 41.53,76.54 45.82,72.25 55.52,72.25 55.72,72.46 63.07,72.46 64.39,73.78 64.6,73.78 U1.10
D7  (via drill 0.35)
  Top 0.203: OR1.2 41.43,85.93 v40.31,85.93 37.15,85.93 OQ1.1 | v62.76,73.99 63.48,73.99 63.88,74.39 64.09,74.39 U1.11
  Bottom 0.203: v62.76,73.99 62.76,85.72 63.58,86.54 63.58,91.74 62.15,93.17 58.17,93.17 50.92,85.93 v40.31,85.93
D8
  Top 0.203: SV1.2 79.7,62.66 79.29,62.25 73.27,62.25 NIR1.1 73.27,62.35 73.27,66.64 64.5,75.42 64.19,75.42 63.78,75.01 U1.12
D9
  Top 0.203: SV2.2 79.7,75.21 79.19,74.7 73.27,74.7 NIR2.1 73.17,74.7 71.84,76.03 63.68,76.03 63.27,75.62 63.07,75.62 U1.13
D10  (via drill 0.35)
  Top 0.203: v31.53,37.04 31.64,37.15 31.64,38.17 ER2.1 31.64,38.27 v29.08,40.82 | v35.72,37.04 36.02,37.04 36.23,36.84 37.04,36.84 ENC.9 | v59.9,75.62 61.64,75.62 62.15,76.13 62.35,76.13 U1.14
  Bottom 0.203: v35.72,37.04 v31.53,37.04 | v59.9,75.62 51.43,75.62 24.29,48.47 23.88,48.47 23.47,48.07 23.47,47.45 24.29,46.64 28.68,46.64 29.08,46.23 v29.08,40.82
D11  (via drill 0.35)
  Top 0.203: v62.35,86.33 62.35,77.46 61.94,77.05 61.94,76.74 U1.15 | v35.72,38.68 36.23,38.17 37.04,38.17 ENC.7 | v38.78,56.54 37.35,56.54 34.9,58.98 v34.9,60.11
  Bottom 0.203: v62.35,86.33 62.35,87.36 61.43,88.27 61.43,90.21 62.45,91.23 BL.4 62.25,91.13 60.62,92.76 59.29,92.76 58.07,91.54 58.07,85.72 34.9,62.56 v34.9,60.11 | v35.72,38.68 35.72,53.47 v38.78,56.54
D12  (via drill 0.35)
  Top 0.203: v61.23,85.31 61.23,77.35 U1.16 | v40.21,54.29 40.21,41.02 37.96,38.78 37.15,38.78 ENC.6 | v40.21,57.96 40.21,58.78 45.92,64.5 v45.92,71.13
  Bottom 0.203: v61.23,85.31 61.23,87.46 60.01,88.68 BL.1 60.01,88.78 61.03,89.8 61.03,91.74 60.41,92.36 59.49,92.36 58.48,91.33 58.48,85.52 45.92,72.97 v45.92,71.13 | v40.21,57.96 v40.21,54.29
D13  (via drill 0.35)
  Top 0.203: U1.17 59.29,77.35 59.29,85.52 62.45,88.68 BL.3 62.56,88.68 63.58,88.68 64.6,87.66 66.44,87.66 v66.54,87.76 | 38.01,37.3 37.96,37.35 37.15,37.35 ENC.8 | 38.01,37.3 42.35,32.96 46.43,32.96 47.05,32.35 47.05,30 51.74,25.31 66.33,25.31 R6.1 | v61.33,57.25 52.86,57.25 40.62,45 40.62,39.9 38.01,37.3
  Bottom 0.203: v66.54,87.76 69.9,84.39 69.9,65.82 v61.33,57.25
DTR
  Top 0.203: C2.2 54.19,80.52 54.19,84.5 59.8,90.11 60.31,90.11 61.43,91.23 61.43,91.74 62.05,92.36 75.31,92.36 78.78,88.89 80.93,88.89 82.05,87.76 82.05,60.21 76.95,55.11 72.25,55.11 PP.1
EP4
  Top 0.203: ER6.2 60.31,37.66 60.31,41.33 EL1.2 | EC4.1 52.25,31.53 55.01,34.29 55.01,36.64 55.92,37.55 ER7.2 56.02,37.66 60.21,37.66 ER6.2 | U$2.P4 66.33,35.72 63.17,35.72 61.23,37.66 60.41,37.66 ER6.2
EP5
  Top 0.203: EC5.1 52.25,28.78 54.39,28.78 55.92,30.31 ER8.1 56.02,30.41 60.21,30.41 ER9.1 60.31,30.41 64.09,34.19 66.94,34.19 68.88,36.13 68.88,36.94 U$2.P5
GND  (via drill 0.35)
  Top 0.203: U$2.Y- 80.82,40.31 80.82,32.25 U$2.G- | PJ1.GND 82.05,15.72 82.05,20 82.66,20.61 82.66,24.29 81.54,25.41 SR.2 81.44,25.41 79.7,25.41 79.5,25.21 72.97,25.21 INDL.C | 72.86,20.92 72.86,25.21 INDL.C | 72.86,20.92 72.86,20 PL.C | ENC.22 44.39,38.06 44.39,37.45 ENC.21 44.29,37.35 43.47,37.35 43.27,37.15 43.27,35.82 43.58,35.51 44.29,35.51 ENC.18 44.39,35.41 45.31,35.41 45.51,35.21 48.07,35.21 v49.29,33.98 | 50.41,30 50.41,31.43 EC4.2 | 50.41,30 50.41,28.78 EC5.2 | v50.92,30 50.41,30 | INDL.C 72.76,25.31 72.76,28.17 72.35,28.57 U$2.SHIELD1 | 72.86,20.92 65.82,20.92 64.6,19.7 59.8,19.7 PC2.- | EC1.2 52.15,34.09 52.15,36.74 EC2.2 52.25,36.84 53.68,36.84 58.98,42.15 65.01,42.15 66.33,40.82 U$2.GND 66.44,40.82 69.09,40.82 72.25,43.98 U$2.SHIELD2 | 63.42,68.02 63.98,68.58 63.98,69.09 U1.5 | 63.42,68.02 63.37,67.97 63.07,67.97 62.76,68.27 62.45,68.27 U1.3 | 67.61,63.53 67.56,63.48 67.05,63.48 63.48,67.05 63.48,67.97 63.42,68.02 | 67.61,63.53 68.17,64.09 68.17,64.7 Q1.2 | 67.61,63.53 67.66,63.48 67.66,57.05 72.15,52.56 PP.2 | 32.45,41.33 32.25,41.33 32.04,41.53 EC3.- 32.45,41.33 | 32.45,41.33 37.04,41.33 ENC.2 | ER10.2 32.45,32.25 32.45,27.86 32.66,27.66 PC1.- 32.66,27.55 28.37,23.27 28.37,16.53 | ENC.11 37.04,35.41 35.51,35.41 32.45,32.35 ER10.2 | 32.45,41.33 32.45,36.94 31.43,35.92 31.12,35.92 30.92,35.72 30.92,34.19 32.55,32.55 ER10.2 | IR6.1 11.53,10.51 13.68,10.51 14.49,9.7 IC6.2 | IR7.1 11.33,4.08 14.7,4.08 14.9,3.88 IC7.2 15,3.88 16.94,5.82 17.04,5.82 | 17.04,5.82 17.45,5.82 ID7.1 | 17.04,5.82 14.59,8.27 14.59,9.59 IC6.2 | PIC33.5 43.88,16.53 43.88,16.12 44.9,15.1 46.23,15.1 47.25,16.12 PIC33.3
  Top 0.203: PIC33.5 43.88,16.63 43.88,16.94 44.8,17.86 44.8,21.94 PD2.A 44.9,22.04 45.92,23.06 v46.64,23.06 | 22.04,10.92 22.04,15.31 ID5.1 | 22.04,10.92 22.04,8.47 ID6.1 | ID5.1 21.53,15.92 15,15.92 IC5.2 14.9,15.82 11.53,15.82 IR5.1 11.43,15.82 9.39,15.82 8.67,15.1 5.51,15.1 4.59,16.02 4.59,17.04 7.76,20.21 10.82,20.21 11.43,20.82 IR4.1 11.53,20.82 14.9,20.82 IC4.2 15,20.92 15.41,21.33 17.25,21.33 ID4.1 17.35,21.43 18.37,22.45 18.78,22.45 20.05,23.73 | 28.37,16.53 23.27,16.53 22.14,15.41 ID5.1 | 28.37,16.53 43.78,16.53 PIC33.5 | 22.04,10.92 18.98,10.92 17.76,9.7 14.59,9.7 IC6.2 | OL1.C 12.35,88.89 15.41,88.89 21.12,94.6 33.57,94.6 37.04,91.13 OQ1.3 37.15,91.03 39.59,91.03 42.45,88.17 42.45,77.66 | 47.35,77.66 47.35,77.76 49.09,79.5 C3.2 | 47.35,77.66 47.35,75.31 C1.1 47.35,75.21 48.27,74.29 50.11,74.29 51.43,75.62 56.02,75.62 56.64,75.01 56.84,75.01 U1.21 | 13.37,68.58 20.61,68.58 21.43,69.39 30.21,69.39 34.9,74.09 34.9,75.82 37.04,77.97 OQ2.3 37.15,77.97 37.45,77.66 42.45,77.66 | 13.37,68.58 12.35,68.58 OL3.C 12.25,68.48 6.74,68.48 4.08,65.82 4.08,56.23 5.82,54.49 5.82,53.88 4.59,52.66 4.59,49.7 7.14,47.15 XI.2 | v13.37,77.46 12.35,78.48 OL2.C | 13.37,68.58 v13.37,69.5 | 42.45,77.66 47.35,77.66 | 20.05,23.73 21.43,25.1 22.04,25.1 ID3.1 | ID1.1 16.74,36.13 14.8,36.13 IC1.2 14.7,36.13 11.53,36.13 IR1.1 11.43,36.02 9.29,36.02 6.43,33.17 5.41,33.17 5.36,33.12 | IR3.1 11.53,26.12 14.9,26.12 IC3.2 15.1,26.12 15.92,26.12 16.79,26.99 | ID2.1 17.25,29.7 16.33,29.7 15,31.02 IC2.2 14.9,31.12 11.53,31.12 IR2.1 11.43,31.02 10.82,30.41 5.41,30.41 4.59,31.23 4.59,32.35 5.36,33.12
  Top 0.203: 16.79,26.99 17.35,27.55 17.35,29.59 ID2.1 | WIFI.GND 25.21,41.74 25.21,40.62 26.12,39.7 26.12,33.47 23.37,30.72 18.37,30.72 17.35,29.7 ID2.1 | 16.79,26.99 20.05,23.73 | OQ3.3 37.35,65.01 37.35,64.19 30.72,57.56 30.72,56.64 21.12,47.05 7.14,47.05 XI.2 | 5.36,33.12 5.31,33.17 5.31,35.62 4.59,36.33 4.59,44.49 7.04,46.94 XI.2
  Bottom 0.203: U$2.G- 80.93,32.15 80.93,31.02 81.84,30.11 81.84,25.82 81.54,25.51 SR.2 | v50.92,30 70.92,30 72.25,28.68 U$2.SHIELD1 | v49.29,33.98 49.29,31.64 v50.92,30 | SV3.3 79.8,90.21 79.8,90.01 81.64,88.17 81.64,79.6 79.8,77.76 SV2.3 79.8,77.66 81.64,75.82 81.64,68.99 79.8,67.15 79.8,65.31 SV1.3 79.7,65.21 79.7,65.01 74.09,59.39 74.09,54.39 72.25,52.56 PP.2 72.25,52.45 74.09,50.62 74.09,45.82 74.04,45.77 | 74.04,45.77 72.35,44.09 U$2.SHIELD2 | U$2.Y- 80.82,40.41 80.82,40.82 75.92,45.72 74.09,45.72 74.04,45.77 | v13.37,69.5 v13.37,77.46 | v46.64,23.06 50.82,27.25 50.82,30 v50.92,30
LEDA
  Top 0.203: ER3.1 50.41,47.25 69.5,47.25 71.23,45.51 78.27,45.51 80.82,42.96 U$2.Y+
LEDB
  Top 0.203: ER4.1 46.23,47.35 46.64,47.35 47.86,48.58 68.78,48.58 71.44,45.92 79.29,45.92 81.84,43.37 81.84,30.61 80.93,29.7 U$2.G+
N$1
  Top 0.203: OQ3.2 25.92,62.45 25.1,61.64 17.55,61.64 OD3.A 17.45,61.64 14.08,65.01 7.14,65.01 XO.6
N$2
  Top 0.203: PD1.C 64.29,5.51 61.54,5.51 PF1.1
N$3
  Top 0.203: OQ1.2 25.61,88.48 25.51,88.38 17.04,88.38 OD1.A 16.94,88.27 16.53,87.86 11.74,87.86 9.29,85.42 7.14,85.42 XO.2
N$4
  Top 0.203: OQ2.2 25.61,75.42 24.08,73.88 17.04,73.88 OD2.A 16.94,73.88 12.35,73.88 11.12,75.11 7.14,75.11 XO.4
N$5
  Top 0.203: R6.2 68.17,25.31 70.62,25.31 INDL.A
N$6
  Top 0.203: OR3.1 41.43,63.48 41.43,64.39 37.25,68.58 21.23,68.58 19.49,66.84 12.65,66.84 12.35,66.54 OL3.A
N$7
  Top 0.203: OL2.A 12.35,76.54 13.47,76.54 17.55,80.62 20.21,80.62 21.12,81.54 38.37,81.54 41.43,78.48 OR2.1
N$8
  Top 0.203: OL1.A 12.35,86.64 17.66,86.64 20.92,83.38 20.92,82.66 21.12,82.46 30.31,82.46 34.9,87.05 34.9,87.15 35.31,87.56 41.43,87.56 OR1.1
N$9
  Top 0.203: ER3.2 48.58,47.25 48.58,44.7 45.21,41.33 44.39,41.33 ENC.27
N$10  (1 unrouted)
  Top 0.203: U1.8 65.31,71.13 65.31,70.92 67.56,68.68 67.56,67.15 67.63,67.07
N$11
  Top 0.203: PR1.1 68.17,20 70.62,20 PL.A
N$12
  Top 0.203: IIR1.2 12.04,39.7 9.9,39.7 7.14,36.94 XI.4
N$13
  Top 0.203: ENC.1 37.04,42.05 34.39,42.05 32.04,44.39 EC3.+
N$14
  Top 0.203: ER4.2 44.29,47.25 44.29,43.37 43.27,42.35 43.27,41.02 43.58,40.72 44.29,40.72 ENC.26
N$15  (1 unrouted)
  Top 0.203: U1.7 64.7,70.62 64.7,70.42 65.82,69.29 65.82,65.41 65.93,65.37
N$16
  Top 0.203: PD2.C 49.19,21.94 48.98,21.74 48.98,16.63 PIC33.2 48.88,16.53 48.88,16.12 47.45,14.7 38.88,14.7 38.06,13.88 38.06,9.8 33.27,5 PCO.P$2
N$17
  Top 0.203: ER1.1 31.74,35 34.49,35 35.51,36.02 37.04,36.02 ENC.10
N$18
  Top 0.203: PD1.A 68.68,5.51 73.99,5.51 74.29,5.82 80.52,5.82 81.95,4.39 PJ1.VIN0
N$19
  Top 0.203: ER10.1 34.19,32.35 35.92,32.35 37.04,33.47 ENC.14
N$20
  Top 0.203: IIR2.2 12.04,34.49 9.8,34.49 7.14,31.84 XI.5
N$21
  Top 0.203: IIR3.2 12.04,29.49 9.9,29.49 7.14,26.74 XI.6
N$22
  Top 0.203: 50.41,39.39 50.41,41.23 51.13,41.94 Q2.1 | 50.41,39.39 50.41,36.84 EC2.1 | 50.41,39.39 44.39,39.39 ENC.24
N$23
  Top 0.203: IIR4.2 12.04,24.49 10,24.49 7.14,21.64 XI.7
N$24
  Top 0.203: 49.75,34.65 45.72,38.68 44.39,38.68 ENC.23 | 49.75,34.65 50.31,34.09 EC1.1 | 49.75,34.65 51.13,36.02 51.13,37.25 54.8,40.92 54.8,41.94 Q2.2
N$25
  Top 0.203: IIR5.2 12.04,19.18 9.7,19.18 7.14,16.63 XI.8
N$26
  Top 0.203: IIR6.2 12.04,14.19 9.8,14.19 7.14,11.53 XI.9
N$27
  Top 0.203: IIR7.2 12.04,7.45 8.16,7.45 7.14,6.43 XI.10
RAW_IV  (via drill 0.35)
  Top 0.254: PF1.2 56.43,5.51 56.43,10.1 50.72,15.82 50.72,16.53 PIC33.1 50.82,16.53 50.82,23.27 50.31,23.78 43.68,23.78 39.29,19.39 32.76,19.39 PC1.+ 32.66,19.39 v29.08,22.96 | OD3.C 17.45,65.82 13.37,65.82 13.06,65.52 9.7,65.52 8.78,66.44 5.41,66.44 4.59,65.62 4.59,56.43 7.04,53.98 7.04,52.15 XI.1 | OD1.C 16.94,92.56 9.18,92.56 7.14,90.52 XO.1 7.04,90.42 7.04,88.38 4.59,85.93 4.59,82.86 7.04,80.42 XO.3 7.14,80.21 7.14,79.8 7.81,79.14 | 7.81,79.14 11.43,75.52 13.16,75.52 15.72,78.07 16.94,78.07 OD2.C | 7.81,79.14 4.59,75.92 4.59,74.6 7.04,72.15 7.04,70.21 XO.5
  Bottom 0.254: XO.5 7.04,70.11 4.39,67.45 4.39,53.88 6.12,52.15 7.04,52.15 XI.1 7.14,52.05 9.59,49.6 9.59,45.72 29.08,26.23 v29.08,22.96
RD+  (via drill 0.35)
  Top 0.203: v58.98,32.25 56.02,32.25 ER8.2 | v46.33,32.04 42.66,32.04 40.62,34.09 37.15,34.09 ENC.13
  Bottom 0.203: U$2.RD+ 68.88,34.39 66.23,34.39 64.09,32.25 v58.98,32.25 56.54,34.7 48.98,34.7 v46.33,32.04
RD-  (via drill 0.35)
  Top 0.203: v62.66,34.59 60.31,32.25 ER9.2 | v39.39,34.9 37.15,34.9 ENC.12
  Bottom 0.203: U$2.RD- 66.33,38.27 v62.66,34.59 62.66,34.7 60.62,36.74 43.37,36.74 41.53,34.9 v39.39,34.9
RESET  (via drill 0.35)
  Top 0.203: R2.1 51.53,83.07 51.53,81.54 53.58,79.5 54.9,79.5 55.82,80.42 C2.1 55.92,80.52 55.92,83.17 61.43,88.68 61.43,89.19 62.05,89.8 63.98,89.8 65.01,88.78 BL.5 | v58.78,70.21 57.56,68.99 U1.29
  Bottom 0.203: v58.78,70.21 60.31,70.21 60.36,70.26 | 60.36,70.26 64.6,74.5 64.6,88.27 65.01,88.68 BL.5 | 60.36,70.26 60.62,70.01 60.62,46.94 62.45,45.11 65.11,45.11 78.37,31.84 78.37,30.72 80.52,28.57 80.52,26.23 80.42,26.12 80.42,25 81.44,23.98 81.44,21.02 SR.1
RXI
  Top 0.203: U1.30 57.96,68.27 57.96,67.97 57.15,67.15 57.15,62.45 72.15,47.45 PP.4
TD+  (via drill 0.35)
  Top 0.203: ER6.1 60.31,35.82 62.45,35.82 63.58,34.7 66.84,34.7 67.97,35.82 67.97,37.35 68.58,37.96 69.39,37.96 70.01,37.35 70.01,32.96 68.99,31.94 U$2.TD+ | v52.45,32.76 49.49,32.76 47.45,34.8 44.39,34.8 ENC.17
  Bottom 0.203: v52.45,32.76 57.45,32.76 58.68,31.53 68.58,31.53 68.88,31.84 U$2.TD+
TD-
  Top 0.203: 51.08,28.01 50.82,27.76 49.9,27.76 47.45,30.21 47.45,32.55 45.92,34.09 44.39,34.09 ENC.16 | 51.08,28.01 51.13,28.06 51.13,29.19 51.64,29.7 51.84,29.7 55.92,33.78 55.92,35.82 ER7.1 | 51.08,28.01 51.33,27.76 59.19,27.76 64.5,33.06 66.33,33.06 U$2.TD-
TXO
  Top 0.203: U1.31 58.58,67.76 58.58,67.56 57.56,66.54 57.56,64.6 72.15,50.01 PP.3

### Text on the board
tPlace: Edge | IOTECH © 2019 | www.iotech.com.tr | IOTB v1.2 TOP | S/N:
bPlace: IOTECH | IOTB BOT